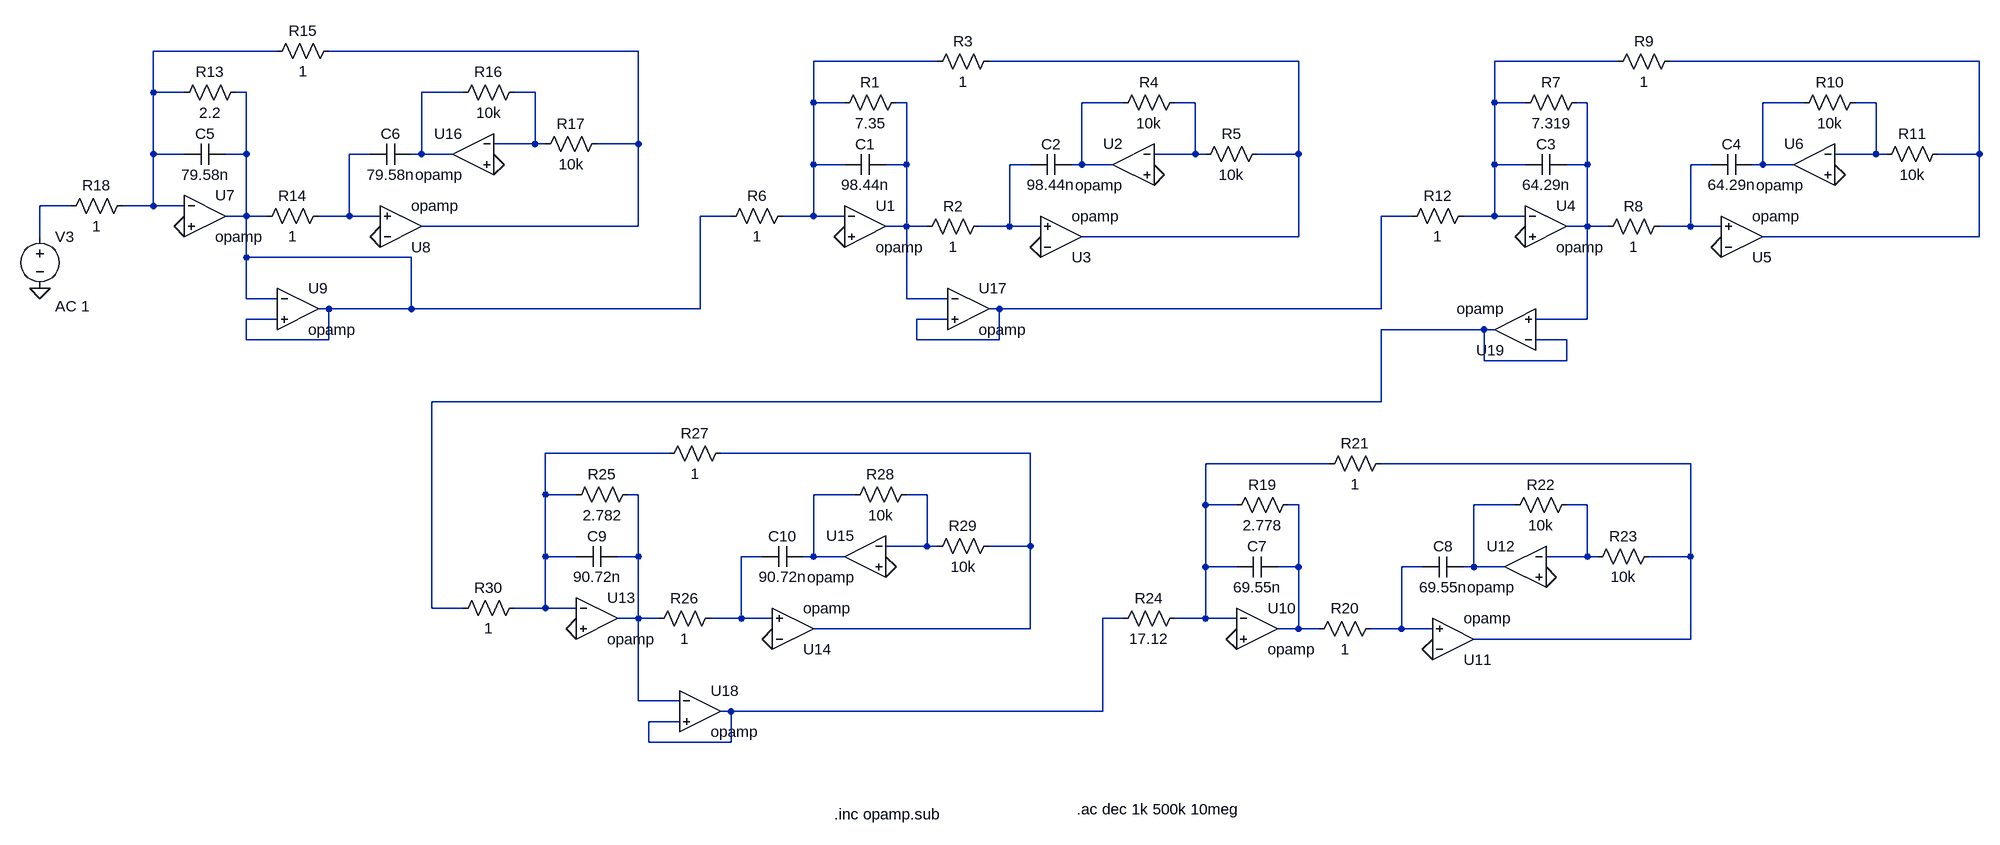
[diagram p0: schematic EJE7.asc]
EJE7.asc, the LTspice schematic file:
Version 4
SHEET 1 1816 1184
WIRE -832 -16 -1024 -16
WIRE -272 -16 -752 -16
WIRE 192 0 0 0
WIRE 752 0 272 0
WIRE 1248 0 1056 0
WIRE 1808 0 1328 0
WIRE -1024 48 -1024 -16
WIRE -976 48 -1024 48
WIRE -880 48 -896 48
WIRE -544 48 -608 48
WIRE -432 48 -464 48
WIRE 0 64 0 0
WIRE 48 64 0 64
WIRE 144 64 128 64
WIRE 480 64 416 64
WIRE 592 64 560 64
WIRE 1056 64 1056 0
WIRE 1104 64 1056 64
WIRE 1200 64 1184 64
WIRE 1536 64 1472 64
WIRE 1648 64 1616 64
WIRE -432 128 -432 48
WIRE -432 128 -496 128
WIRE -416 128 -432 128
WIRE -272 128 -272 -16
WIRE -272 128 -336 128
WIRE -1024 144 -1024 48
WIRE -976 144 -1024 144
WIRE -880 144 -880 48
WIRE -880 144 -912 144
WIRE -688 144 -720 144
WIRE -608 144 -608 48
WIRE -608 144 -624 144
WIRE -560 144 -608 144
WIRE 592 144 592 64
WIRE 592 144 528 144
WIRE 608 144 592 144
WIRE 752 144 752 0
WIRE 752 144 688 144
WIRE 1648 144 1648 64
WIRE 1648 144 1584 144
WIRE 1664 144 1648 144
WIRE 1808 144 1808 0
WIRE 1808 144 1744 144
WIRE 0 160 0 64
WIRE 48 160 0 160
WIRE 144 160 144 64
WIRE 144 160 112 160
WIRE 336 160 304 160
WIRE 416 160 416 64
WIRE 416 160 400 160
WIRE 464 160 416 160
WIRE 1056 160 1056 64
WIRE 1104 160 1056 160
WIRE 1200 160 1200 64
WIRE 1200 160 1168 160
WIRE 1392 160 1360 160
WIRE 1472 160 1472 64
WIRE 1472 160 1456 160
WIRE 1520 160 1472 160
WIRE -1152 224 -1200 224
WIRE -1024 224 -1024 144
WIRE -1024 224 -1072 224
WIRE -976 224 -1024 224
WIRE -880 240 -880 144
WIRE -880 240 -912 240
WIRE -848 240 -880 240
WIRE -720 240 -720 144
WIRE -720 240 -768 240
WIRE -672 240 -720 240
WIRE -128 240 -176 240
WIRE 0 240 0 160
WIRE 0 240 -48 240
WIRE 48 240 0 240
WIRE 928 240 880 240
WIRE 1056 240 1056 160
WIRE 1056 240 1008 240
WIRE 1104 240 1056 240
WIRE -272 256 -272 128
WIRE -272 256 -608 256
WIRE 144 256 144 160
WIRE 144 256 112 256
WIRE 176 256 144 256
WIRE 304 256 304 160
WIRE 304 256 256 256
WIRE 352 256 304 256
WIRE 1200 256 1200 160
WIRE 1200 256 1168 256
WIRE 1232 256 1200 256
WIRE 1360 256 1360 160
WIRE 1360 256 1312 256
WIRE 1408 256 1360 256
WIRE -1200 272 -1200 224
WIRE 752 272 752 144
WIRE 752 272 416 272
WIRE 1808 272 1808 144
WIRE 1808 272 1472 272
WIRE -880 304 -880 240
WIRE -624 304 -880 304
WIRE -880 368 -880 304
WIRE -832 368 -880 368
WIRE 144 368 144 256
WIRE 208 368 144 368
WIRE -752 384 -768 384
WIRE -624 384 -624 304
WIRE -624 384 -752 384
WIRE -176 384 -176 240
WIRE -176 384 -624 384
WIRE 288 384 272 384
WIRE 880 384 880 240
WIRE 880 384 288 384
WIRE -832 400 -880 400
WIRE 208 400 160 400
WIRE 1200 400 1200 256
WIRE 1200 400 1120 400
WIRE 1040 416 880 416
WIRE 1056 416 1040 416
WIRE -880 432 -880 400
WIRE -752 432 -752 384
WIRE -752 432 -880 432
WIRE 160 432 160 400
WIRE 288 432 288 384
WIRE 288 432 160 432
WIRE 1168 432 1120 432
WIRE 1040 464 1040 416
WIRE 1168 464 1168 432
WIRE 1168 464 1040 464
WIRE 880 528 880 416
WIRE 880 528 -592 528
WIRE -224 608 -416 608
WIRE 336 608 -144 608
WIRE 800 624 608 624
WIRE 1360 624 880 624
WIRE -416 672 -416 608
WIRE -368 672 -416 672
WIRE -272 672 -288 672
WIRE 64 672 0 672
WIRE 176 672 144 672
WIRE 608 688 608 624
WIRE 656 688 608 688
WIRE 752 688 736 688
WIRE 1088 688 1024 688
WIRE 1200 688 1168 688
WIRE 176 752 176 672
WIRE 176 752 112 752
WIRE 192 752 176 752
WIRE 336 752 336 608
WIRE 336 752 272 752
WIRE -416 768 -416 672
WIRE -368 768 -416 768
WIRE -272 768 -272 672
WIRE -272 768 -304 768
WIRE -80 768 -112 768
WIRE 0 768 0 672
WIRE 0 768 -16 768
WIRE 48 768 0 768
WIRE 1200 768 1200 688
WIRE 1200 768 1136 768
WIRE 1216 768 1200 768
WIRE 1360 768 1360 624
WIRE 1360 768 1296 768
WIRE 608 784 608 688
WIRE 656 784 608 784
WIRE 752 784 752 688
WIRE 752 784 720 784
WIRE 944 784 912 784
WIRE 1024 784 1024 688
WIRE 1024 784 1008 784
WIRE 1072 784 1024 784
WIRE -592 848 -592 528
WIRE -544 848 -592 848
WIRE -416 848 -416 768
WIRE -416 848 -464 848
WIRE -368 848 -416 848
WIRE -272 864 -272 768
WIRE -272 864 -304 864
WIRE -240 864 -272 864
WIRE -112 864 -112 768
WIRE -112 864 -160 864
WIRE -64 864 -112 864
WIRE 480 864 448 864
WIRE 608 864 608 784
WIRE 608 864 560 864
WIRE 656 864 608 864
WIRE 336 880 336 752
WIRE 336 880 0 880
WIRE 752 880 752 784
WIRE 752 880 720 880
WIRE 784 880 752 880
WIRE 912 880 912 784
WIRE 912 880 864 880
WIRE 960 880 912 880
WIRE 1360 896 1360 768
WIRE 1360 896 1024 896
WIRE -272 992 -272 864
WIRE -208 992 -272 992
WIRE -128 1008 -144 1008
WIRE 448 1008 448 864
WIRE 448 1008 -128 1008
WIRE -208 1024 -256 1024
WIRE -256 1056 -256 1024
WIRE -128 1056 -128 1008
WIRE -128 1056 -256 1056
FLAG 48 272 0
FLAG 528 176 0
FLAG 1104 272 0
FLAG 1584 176 0
FLAG -976 256 0
FLAG -496 160 0
FLAG -1200 352 0
FLAG 656 896 0
FLAG 1136 800 0
FLAG -368 880 0
FLAG 112 784 0
FLAG 352 288 0
FLAG 1408 288 0
FLAG 960 912 0
FLAG -672 272 0
FLAG -64 896 0
SYMBOL cap 112 144 R90
WINDOW 0 0 32 VBottom 2
WINDOW 3 32 32 VTop 2
SYMATTR InstName C1
SYMATTR Value 98.44n
SYMBOL res 144 48 R90
WINDOW 0 0 56 VBottom 2
WINDOW 3 32 56 VTop 2
SYMATTR InstName R1
SYMATTR Value 7.35
SYMBOL res 272 240 R90
WINDOW 0 0 56 VBottom 2
WINDOW 3 32 56 VTop 2
SYMATTR InstName R2
SYMATTR Value 1
SYMBOL res 288 -16 R90
WINDOW 0 0 56 VBottom 2
WINDOW 3 32 56 VTop 2
SYMATTR InstName R3
SYMATTR Value 1
SYMBOL cap 400 144 R90
WINDOW 0 0 32 VBottom 2
WINDOW 3 32 32 VTop 2
SYMATTR InstName C2
SYMATTR Value 98.44n
SYMBOL res 576 48 R90
WINDOW 0 0 56 VBottom 2
WINDOW 3 32 56 VTop 2
SYMATTR InstName R4
SYMATTR Value 10k
SYMBOL res 704 128 R90
WINDOW 0 0 56 VBottom 2
WINDOW 3 32 56 VTop 2
SYMATTR InstName R5
SYMATTR Value 10k
SYMBOL res -32 224 R90
WINDOW 0 0 56 VBottom 2
WINDOW 3 32 56 VTop 2
SYMATTR InstName R6
SYMATTR Value 1
SYMBOL cap 1168 144 R90
WINDOW 0 0 32 VBottom 2
WINDOW 3 32 32 VTop 2
SYMATTR InstName C3
SYMATTR Value 64.29n
SYMBOL res 1200 48 R90
WINDOW 0 0 56 VBottom 2
WINDOW 3 32 56 VTop 2
SYMATTR InstName R7
SYMATTR Value 7.319
SYMBOL res 1328 240 R90
WINDOW 0 0 56 VBottom 2
WINDOW 3 32 56 VTop 2
SYMATTR InstName R8
SYMATTR Value 1
SYMBOL res 1344 -16 R90
WINDOW 0 0 56 VBottom 2
WINDOW 3 32 56 VTop 2
SYMATTR InstName R9
SYMATTR Value 1
SYMBOL cap 1456 144 R90
WINDOW 0 0 32 VBottom 2
WINDOW 3 32 32 VTop 2
SYMATTR InstName C4
SYMATTR Value 64.29n
SYMBOL res 1632 48 R90
WINDOW 0 0 56 VBottom 2
WINDOW 3 32 56 VTop 2
SYMATTR InstName R10
SYMATTR Value 10k
SYMBOL res 1760 128 R90
WINDOW 0 0 56 VBottom 2
WINDOW 3 32 56 VTop 2
SYMATTR InstName R11
SYMATTR Value 10k
SYMBOL res 1024 224 R90
WINDOW 0 0 56 VBottom 2
WINDOW 3 32 56 VTop 2
SYMATTR InstName R12
SYMATTR Value 1
SYMBOL cap -912 128 R90
WINDOW 0 0 32 VBottom 2
WINDOW 3 32 32 VTop 2
SYMATTR InstName C5
SYMATTR Value 79.58n
SYMBOL res -880 32 R90
WINDOW 0 0 56 VBottom 2
WINDOW 3 32 56 VTop 2
SYMATTR InstName R13
SYMATTR Value 2.2
SYMBOL res -752 224 R90
WINDOW 0 0 56 VBottom 2
WINDOW 3 32 56 VTop 2
SYMATTR InstName R14
SYMATTR Value 1
SYMBOL OpAmps\\opamp -944 176 R0
SYMATTR InstName U7
SYMATTR SpiceLine Aol=10000K
SYMATTR SpiceLine2 GBW=1000Meg
SYMBOL res -736 -32 R90
WINDOW 0 0 56 VBottom 2
WINDOW 3 32 56 VTop 2
SYMATTR InstName R15
SYMATTR Value 1
SYMBOL cap -624 128 R90
WINDOW 0 0 32 VBottom 2
WINDOW 3 32 32 VTop 2
SYMATTR InstName C6
SYMATTR Value 79.58n
SYMBOL res -448 32 R90
WINDOW 0 0 56 VBottom 2
WINDOW 3 32 56 VTop 2
SYMATTR InstName R16
SYMATTR Value 10k
SYMBOL res -320 112 R90
WINDOW 0 0 56 VBottom 2
WINDOW 3 32 56 VTop 2
SYMATTR InstName R17
SYMATTR Value 10k
SYMBOL res -1056 208 R90
WINDOW 0 0 56 VBottom 2
WINDOW 3 32 56 VTop 2
SYMATTR InstName R18
SYMATTR Value 1
SYMBOL voltage -1200 256 R0
WINDOW 123 24 124 Left 2
WINDOW 39 0 0 Left 0
SYMATTR Value2 AC 1
SYMATTR InstName V3
SYMATTR Value ""
SYMBOL cap 720 768 R90
WINDOW 0 0 32 VBottom 2
WINDOW 3 32 32 VTop 2
SYMATTR InstName C7
SYMATTR Value 69.55n
SYMBOL res 752 672 R90
WINDOW 0 0 56 VBottom 2
WINDOW 3 32 56 VTop 2
SYMATTR InstName R19
SYMATTR Value 2.778
SYMBOL res 880 864 R90
WINDOW 0 0 56 VBottom 2
WINDOW 3 32 56 VTop 2
SYMATTR InstName R20
SYMATTR Value 1
SYMBOL res 896 608 R90
WINDOW 0 0 56 VBottom 2
WINDOW 3 32 56 VTop 2
SYMATTR InstName R21
SYMATTR Value 1
SYMBOL cap 1008 768 R90
WINDOW 0 0 32 VBottom 2
WINDOW 3 32 32 VTop 2
SYMATTR InstName C8
SYMATTR Value 69.55n
SYMBOL res 1184 672 R90
WINDOW 0 0 56 VBottom 2
WINDOW 3 32 56 VTop 2
SYMATTR InstName R22
SYMATTR Value 10k
SYMBOL res 1312 752 R90
WINDOW 0 0 56 VBottom 2
WINDOW 3 32 56 VTop 2
SYMATTR InstName R23
SYMATTR Value 10k
SYMBOL res 576 848 R90
WINDOW 0 0 56 VBottom 2
WINDOW 3 32 56 VTop 2
SYMATTR InstName R24
SYMATTR Value 17.12
SYMBOL cap -304 752 R90
WINDOW 0 0 32 VBottom 2
WINDOW 3 32 32 VTop 2
SYMATTR InstName C9
SYMATTR Value 90.72n
SYMBOL res -272 656 R90
WINDOW 0 0 56 VBottom 2
WINDOW 3 32 56 VTop 2
SYMATTR InstName R25
SYMATTR Value 2.782
SYMBOL res -144 848 R90
WINDOW 0 0 56 VBottom 2
WINDOW 3 32 56 VTop 2
SYMATTR InstName R26
SYMATTR Value 1
SYMBOL res -128 592 R90
WINDOW 0 0 56 VBottom 2
WINDOW 3 32 56 VTop 2
SYMATTR InstName R27
SYMATTR Value 1
SYMBOL cap -16 752 R90
WINDOW 0 0 32 VBottom 2
WINDOW 3 32 32 VTop 2
SYMATTR InstName C10
SYMATTR Value 90.72n
SYMBOL res 160 656 R90
WINDOW 0 0 56 VBottom 2
WINDOW 3 32 56 VTop 2
SYMATTR InstName R28
SYMATTR Value 10k
SYMBOL res 288 736 R90
WINDOW 0 0 56 VBottom 2
WINDOW 3 32 56 VTop 2
SYMATTR InstName R29
SYMATTR Value 10k
SYMBOL res -448 832 R90
WINDOW 0 0 56 VBottom 2
WINDOW 3 32 56 VTop 2
SYMATTR InstName R30
SYMATTR Value 1
SYMBOL OpAmps\\opamp -640 320 M180
SYMATTR InstName U8
SYMATTR SpiceLine Aol=10000K
SYMATTR SpiceLine2 GBW=1000Meg
SYMBOL OpAmps\\opamp -528 80 M0
SYMATTR InstName U16
SYMATTR SpiceLine Aol=10000K
SYMATTR SpiceLine2 GBW=1000Meg
SYMBOL OpAmps\\opamp 80 192 R0
SYMATTR InstName U1
SYMATTR SpiceLine Aol=10000K
SYMATTR SpiceLine2 GBW=1000Meg
SYMBOL OpAmps\\opamp 496 96 M0
SYMATTR InstName U2
SYMATTR SpiceLine Aol=10000K
SYMATTR SpiceLine2 GBW=1000Meg
SYMBOL OpAmps\\opamp 384 336 M180
SYMATTR InstName U3
SYMATTR SpiceLine Aol=10000K
SYMATTR SpiceLine2 GBW=1000Meg
SYMBOL OpAmps\\opamp 1136 192 R0
SYMATTR InstName U4
SYMATTR SpiceLine Aol=10000K
SYMATTR SpiceLine2 GBW=1000Meg
SYMBOL OpAmps\\opamp 1440 336 M180
SYMATTR InstName U5
SYMATTR SpiceLine Aol=10000K
SYMATTR SpiceLine2 GBW=1000Meg
SYMBOL OpAmps\\opamp 1552 96 M0
SYMATTR InstName U6
SYMATTR SpiceLine Aol=10000K
SYMATTR SpiceLine2 GBW=1000Meg
SYMBOL OpAmps\\opamp 1088 480 R180
SYMATTR InstName U19
SYMATTR SpiceLine Aol=10000K
SYMATTR SpiceLine2 GBW=1000Meg
SYMBOL OpAmps\\opamp -336 800 R0
SYMATTR InstName U13
SYMATTR SpiceLine Aol=10000K
SYMATTR SpiceLine2 GBW=1000Meg
SYMBOL OpAmps\\opamp -32 944 M180
SYMATTR InstName U14
SYMATTR SpiceLine Aol=10000K
SYMATTR SpiceLine2 GBW=1000Meg
SYMBOL OpAmps\\opamp 80 704 M0
SYMATTR InstName U15
SYMATTR SpiceLine Aol=10000K
SYMATTR SpiceLine2 GBW=1000Meg
SYMBOL OpAmps\\opamp -800 320 R0
SYMATTR InstName U9
SYMATTR SpiceLine Aol=10000K
SYMATTR SpiceLine2 GBW=1000Meg
SYMBOL OpAmps\\opamp 240 320 R0
SYMATTR InstName U17
SYMATTR SpiceLine Aol=10000K
SYMATTR SpiceLine2 GBW=1000Meg
SYMBOL OpAmps\\opamp -176 944 R0
SYMATTR InstName U18
SYMATTR SpiceLine Aol=10000K
SYMATTR SpiceLine2 GBW=1000Meg
SYMBOL OpAmps\\opamp 688 816 R0
SYMATTR InstName U10
SYMATTR SpiceLine Aol=10000K
SYMATTR SpiceLine2 GBW=1000Meg
SYMBOL OpAmps\\opamp 992 960 M180
SYMATTR InstName U11
SYMATTR SpiceLine Aol=10000K
SYMATTR SpiceLine2 GBW=1000Meg
SYMBOL OpAmps\\opamp 1104 720 M0
SYMATTR InstName U12
SYMATTR SpiceLine Aol=10000K
SYMATTR SpiceLine2 GBW=1000Meg
TEXT 32 1168 Left 2 !.inc opamp.sub
TEXT 408 1160 Left 2 !.ac dec 1k 500k 10meg

The netlist it stands for:
* EJE7.asc
C1 N010 N003 98.44n
R1 N010 N003 7.35
R2 N017 N010 1
R3 N004 N003 1
C2 N011 N017 98.44n
R4 N012 N011 10k
R5 N004 N012 10k
R6 N003 N007 1
C3 N013 N005 64.29n
R7 N013 N005 7.319
R8 N018 N013 1
R9 N006 N005 1
C4 N014 N018 64.29n
R10 N015 N014 10k
R11 N006 N015 10k
R12 N005 N020 1
C5 N007 N001 79.58n
R13 N007 N001 2.2
R14 N016 N007 1
XU7 N001 0 N007 opamp Aol=10000K GBW=1000Meg  ; pins invin noninvin out
R15 N002 N001 1
C6 N008 N016 79.58n
R16 N009 N008 10k
R17 N002 N009 10k
R18 N001 N019 1
V3 N019 0 AC 1
C7 N029 N024 69.55n
R19 N029 N024 2.778
R20 N033 N029 1
R21 N025 N024 1
C8 N030 N033 69.55n
R22 N031 N030 10k
R23 N025 N031 10k
R24 N024 N034 17.12
C9 N026 N022 90.72n
R25 N026 N022 2.782
R26 N032 N026 1
R27 N023 N022 1
C10 N027 N032 90.72n
R28 N028 N027 10k
R29 N023 N028 10k
R30 N022 N021 1
XU8 0 N016 N002 opamp Aol=10000K GBW=1000Meg  ; pins invin noninvin out
XU16 N009 0 N008 opamp Aol=10000K GBW=1000Meg  ; pins invin noninvin out
XU1 N003 0 N010 opamp Aol=10000K GBW=1000Meg  ; pins invin noninvin out
XU2 N012 0 N011 opamp Aol=10000K GBW=1000Meg  ; pins invin noninvin out
XU3 0 N017 N004 opamp Aol=10000K GBW=1000Meg  ; pins invin noninvin out
XU4 N005 0 N013 opamp Aol=10000K GBW=1000Meg  ; pins invin noninvin out
XU5 0 N018 N006 opamp Aol=10000K GBW=1000Meg  ; pins invin noninvin out
XU6 N015 0 N014 opamp Aol=10000K GBW=1000Meg  ; pins invin noninvin out
XU19 N021 N013 N021 opamp Aol=10000K GBW=1000Meg  ; pins invin noninvin out
XU13 N022 0 N026 opamp Aol=10000K GBW=1000Meg  ; pins invin noninvin out
XU14 0 N032 N023 opamp Aol=10000K GBW=1000Meg  ; pins invin noninvin out
XU15 N028 0 N027 opamp Aol=10000K GBW=1000Meg  ; pins invin noninvin out
XU9 N007 N007 N007 opamp Aol=10000K GBW=1000Meg  ; pins invin noninvin out
XU17 N010 N020 N020 opamp Aol=10000K GBW=1000Meg  ; pins invin noninvin out
XU18 N026 N034 N034 opamp Aol=10000K GBW=1000Meg  ; pins invin noninvin out
XU10 N024 0 N029 opamp Aol=10000K GBW=1000Meg  ; pins invin noninvin out
XU11 0 N033 N025 opamp Aol=10000K GBW=1000Meg  ; pins invin noninvin out
XU12 N031 0 N030 opamp Aol=10000K GBW=1000Meg  ; pins invin noninvin out
.inc opamp.sub
.ac dec 1k 500k 10meg
.backanno
.end